# EAGLE design buffered-mult-pcb-b (EAGLE 7.2.0)
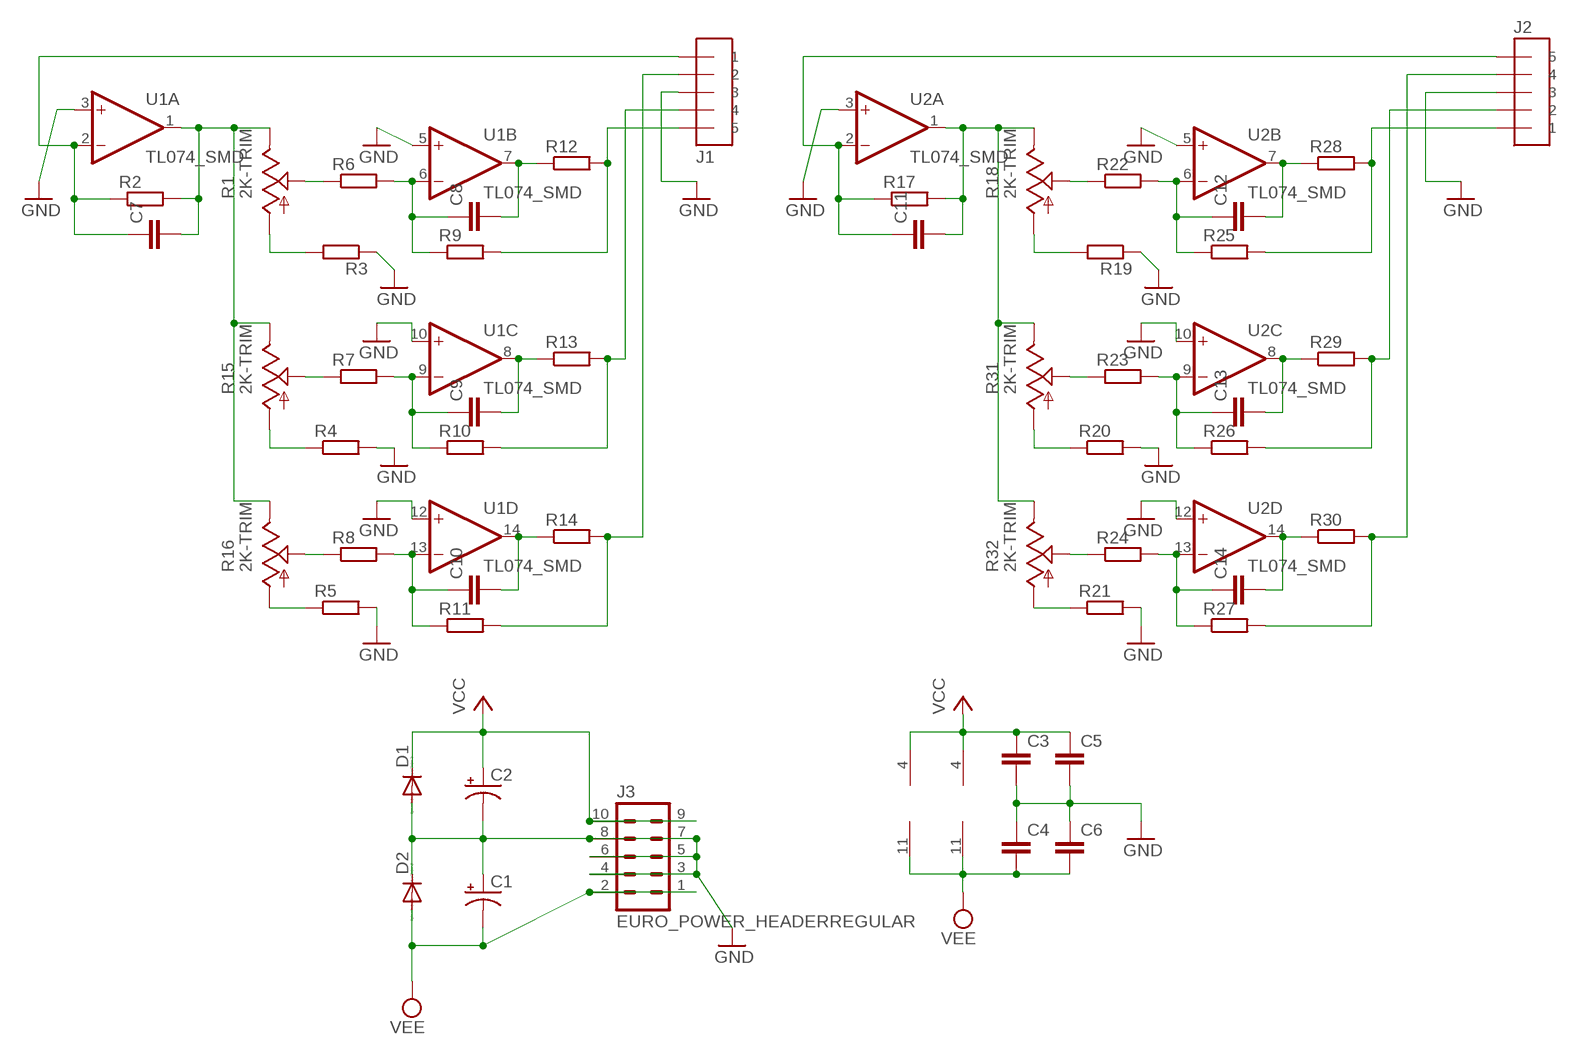
[diagram p0: schematic, sheet 1]

## Parts
C1  CPOL-USD  [PANASONIC_D]
C2  CPOL-USD  [PANASONIC_D]
C3  C-EUC0603  [C0603]
C4  C-EUC0603  [C0603]
C5  C-EUC0603  [C0603]
C6  C-EUC0603  [C0603]
C7  C-EUC0603  [C0603]
C8  C-EUC0603  [C0603]
C9  C-EUC0603  [C0603]
C10  C-EUC0603  [C0603]
C11  C-EUC0603  [C0603]
C12  C-EUC0603  [C0603]
C13  C-EUC0603  [C0603]
C14  C-EUC0603  [C0603]
D1  DIODE-SOD123  [SOD123]
D2  DIODE-SOD123  [SOD123]
J1  5X1_2_54_HEADER  [5X1_2_54_HEADER]
J2  5X1_2_54_HEADER  [5X1_2_54_HEADER]
J3  EURO_POWER_HEADERREGULAR  [EURO_POWER_HEADER]
R1  2K-TRIM  BOURNS_TRIM_3303X3_SMD  [BOURNS_TRIM_3303X3_SMD]
R2  R-EU_R0603  [R0603]
R3  R-EU_R0603  [R0603]
R4  R-EU_R0603  [R0603]
R5  R-EU_R0603  [R0603]
R6  R-EU_R0603  [R0603]
R7  R-EU_R0603  [R0603]
R8  R-EU_R0603  [R0603]
R9  R-EU_R0603  [R0603]
R10  R-EU_R0603  [R0603]
R11  R-EU_R0603  [R0603]
R12  R-EU_R0603  [R0603]
R13  R-EU_R0603  [R0603]
R14  R-EU_R0603  [R0603]
R15  2K-TRIM  BOURNS_TRIM_3303X3_SMD  [BOURNS_TRIM_3303X3_SMD]
R16  2K-TRIM  BOURNS_TRIM_3303X3_SMD  [BOURNS_TRIM_3303X3_SMD]
R17  R-EU_R0603  [R0603]
R18  2K-TRIM  BOURNS_TRIM_3303X3_SMD  [BOURNS_TRIM_3303X3_SMD]
R19  R-EU_R0603  [R0603]
R20  R-EU_R0603  [R0603]
R21  R-EU_R0603  [R0603]
R22  R-EU_R0603  [R0603]
R23  R-EU_R0603  [R0603]
R24  R-EU_R0603  [R0603]
R25  R-EU_R0603  [R0603]
R26  R-EU_R0603  [R0603]
R27  R-EU_R0603  [R0603]
R28  R-EU_R0603  [R0603]
R29  R-EU_R0603  [R0603]
R30  R-EU_R0603  [R0603]
R31  2K-TRIM  BOURNS_TRIM_3303X3_SMD  [BOURNS_TRIM_3303X3_SMD]
R32  2K-TRIM  BOURNS_TRIM_3303X3_SMD  [BOURNS_TRIM_3303X3_SMD]
U1  TL074_SMD  [SO14]
U2  TL074_SMD  [SO14]

## Nets
GND: C1.+ C2.- C3.2 C4.1 C5.2 C6.1 D1.A D2.C J1.3 J2.3 J3.3 J3.4 J3.5 J3.6 J3.7 J3.8 R3.1 R4.2 R5.2 R19.1 R20.2 R21.2 U1.3(A:+IN) U1.5(B:+IN) U1.10(C:+IN) U1.12(D:+IN) U2.3(A:+IN) U2.5(B:+IN) U2.10(C:+IN) U2.12(D:+IN)
N$1: C7.1 J1.1 R2.1 U1.2(A:-IN)
N$2: C7.2 R1.1(E) R2.2 R15.1(E) R16.1(E) U1.1(A:OUT)
N$3: R1.2(S) R6.1
N$4: C8.1 R6.2 R9.1 U1.6(B:-IN)
N$5: C8.2 R12.1 U1.7(B:OUT)
N$6: J1.5 R9.2 R12.2
N$7: R7.1 R15.2(S)
N$8: R1.3(A) R3.2
N$9: C9.1 R7.2 R10.1 U1.9(C:-IN)
N$10: C9.2 R13.1 U1.8(C:OUT)
N$11: J1.4 R10.2 R13.2
N$12: J1.2 R11.2 R14.2
N$13: R4.1 R15.3(A)
N$14: R8.1 R16.2(S)
N$15: C10.1 R8.2 R11.1 U1.13(D:-IN)
N$16: R5.1 R16.3(A)
N$17: C10.2 R14.1 U1.14(D:OUT)
N$19: C11.1 J2.5 R17.1 U2.2(A:-IN)
N$20: C11.2 R17.2 R18.1(E) R31.1(E) R32.1(E) U2.1(A:OUT)
N$21: R18.2(S) R22.1
N$22: C12.1 R22.2 R25.1 U2.6(B:-IN)
N$23: C12.2 R28.1 U2.7(B:OUT)
N$24: J2.1 R25.2 R28.2
N$25: R18.3(A) R19.2
N$26: R23.1 R31.2(S)
N$27: C13.1 R23.2 R26.1 U2.9(C:-IN)
N$28: C13.2 R29.1 U2.8(C:OUT)
N$29: J2.2 R26.2 R29.2
N$30: R20.1 R31.3(A)
N$31: R24.1 R32.2(S)
N$32: C14.1 R24.2 R27.1 U2.13(D:-IN)
N$33: R21.1 R32.3(A)
N$34: C14.2 R30.1 U2.14(D:OUT)
N$35: J2.4 R27.2 R30.2
VCC: C2.+ C3.1 C5.1 D1.C J3.9 J3.10 U1.4(P:V+) U2.4(P:V+)
VEE: C1.- C4.2 C6.2 D2.A J3.1 J3.2 U1.11(P:V-) U2.11(P:V-)

## Library data of the parts
C1 C2 = rcl:CPOL-US: POLARIZED CAPACITOR, American symbol
C3-C14 = rcl:C-EU: CAPACITOR, European symbol
D1 D2 = diode:DIODE-: DIODE
J1 J2 = mjb-parts:5X1_2_54_HEADER
J3 = mjb-parts:EURO_POWER_HEADER: Power Header 10 pin power header for Eurorack Power Supplies Variants with fatter pads for easier soldering, and the LOCK variant which has 5mil offset pins to hold the component in place before soldering
R1 R15 R16 R18 R31 R32 = mjb-parts:BOURNS_TRIM_3303X3_SMD
R2-R14 R17 R19-R30 = rcl:R-EU_: RESISTOR, European symbol
U1 U2 = MusicThingModular:TL074: Generic Quad Op Amp

## Board
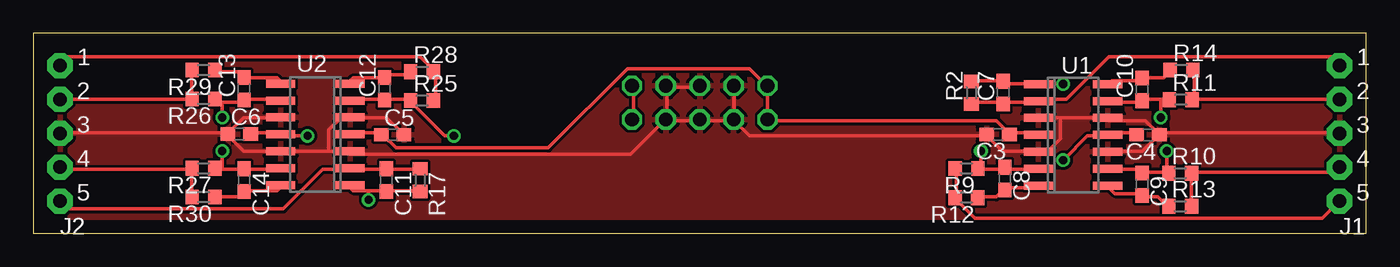
[diagram p1: board, top side]
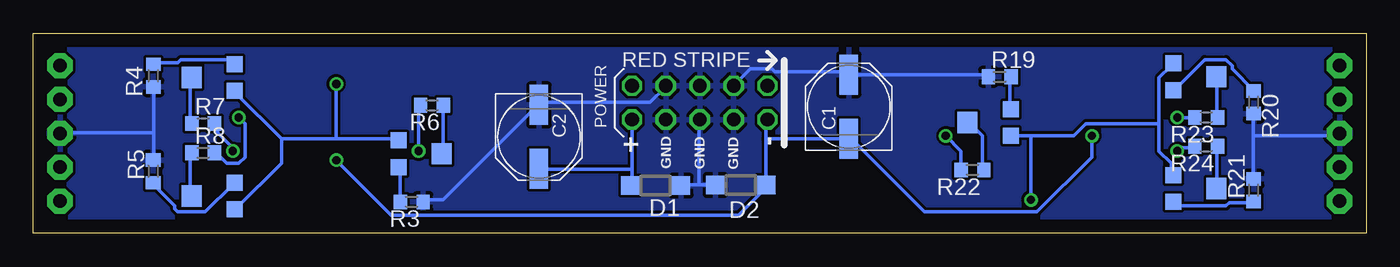
[diagram p2: board, bottom side, seen from below]

Size 100 x 15 mm. Coordinates in mm from the lower left corner, seen from the top.
Outline: 0,0 100,0 100,15 0,15 0,0
Copper layers (1*16): Top 0.035mm / dielectric 1.5mm / Bottom 0.035mm
Design rules "default": minimum track width 10mil, minimum drill 24mil, track to track 8mil, track to pad 8mil, pad to pad 8mil, via to via 8mil, smd to smd 8mil, copper to edge 40mil, drill to drill 8mil, minimum pad ring 10mil, minimum via ring 8mil, stop-mask expansion 4mil, vias tented up to drill 0mil, thermal gap 10mil

### Footprints (pad centres in the part's own frame; a part is rotated, then mirrored left to right if it is on the bottom)
PANASONIC_D = smd 3 x 1.4: + 2.4,0; - -2.4,0
C0603 = smd 1.1 x 1: 1 -0.85,0; 2 0.85,0
SOD123 = smd 1.4 x 1.4: A 1.9,0; C -1.9,0
5X1_2_54_HEADER = drill 1.016 pad 1.88 octagon: 1 0,5.08; 2 0,2.54; 3 0,0; 4 0,-2.54; 5 0,-5.08
EURO_POWER_HEADER = drill 1.016 octagon: 1 -5.08,-1.27; 2 -5.08,1.27; 3 -2.54,-1.27; 4 -2.54,1.27; 5 0,-1.27; 6 0,1.27; 7 2.54,-1.27; 8 2.54,1.27; 9 5.08,-1.27; 10 5.08,1.27
BOURNS_TRIM_3303X3_SMD = smd 1.2 x 1.2: 1 -1,-1.59; 3 1,-1.59 | smd 1.6 x 1.5: 2 0,1.65
R0603 = smd 1 x 1.1: 1 -0.85,0; 2 0.85,0
SO14 = smd 0.6 x 2.2: 1 -3.81,-2.6; 2 -2.54,-2.6; 3 -1.27,-2.6; 4 0,-2.6; 5 1.27,-2.6; 6 2.54,-2.6; 7 3.81,-2.6; 8 3.81,2.6; 9 2.54,2.6; 10 1.27,2.6; 11 0,2.6; 12 -1.27,2.6; 13 -2.54,2.6; 14 -3.81,2.6

### Placement (x,y rotation side)
C1  38.82,9.5 90 bottom
C2  62.06,7.23 270 bottom
C3  72.38,7.42 180 top
C4  83.63,7.39 180 top
C5  26.96,7.39 0 top
C6  15.46,7.45 0 top
C7  72.77,10.56 90 top
C8  72.89,4.11 270 top
C9  83.19,3.68 270 top
C10  83.19,10.79 90 top
C11  26.48,3.99 270 top
C12  26.36,10.85 90 top
C13  15.82,10.85 90 top
C14  15.82,3.99 270 top
D1  53.32,3.58 0 bottom
D2  46.92,3.63 0 bottom
J1  98,7.5 0 top
J2  2,7.5 0 top
J3  50,9.8 180 bottom
R1  71.01,5.97 270 bottom
R2  70.39,10.54 90 top
R3  71.6,2.36 180 bottom
R4  90.99,11.83 270 bottom
R5  91,4.64 90 bottom
R6  70.09,9.61 180 bottom
R7  87.25,8.24 0 bottom
R8  87.26,6.04 0 bottom
R9  70.02,4.87 180 top
R10  86.04,4.51 0 top
R11  86.09,10.02 0 top
R12  70,2.67 180 top
R13  86.04,2.03 0 top
R14  86.15,12.25 0 top
R15  86.49,11.68 90 bottom
R16  86.49,2.79 90 bottom
R17  29.02,3.99 270 top
R18  28.26,8.31 90 bottom
R19  27.5,11.74 0 bottom
R20  8.45,9.83 270 bottom
R21  8.45,3.23 90 bottom
R22  29.53,4.75 180 bottom
R23  12.01,8.69 180 bottom
R24  12.01,6.53 180 bottom
R25  29.15,9.96 0 top
R26  12.77,10.09 180 top
R27  12.77,4.88 180 top
R28  29.15,12.12 0 top
R29  12.77,12.25 180 top
R30  12.77,2.72 180 top
R31  12.89,11.74 270 bottom
R32  12.89,3.36 270 bottom
U1  78.01,7.38 270 top
U2  21.15,7.42 90 top

### Tracks (layer width: path | path; a pad name or v marks a point on that pad's centre or on a via)
GND
  Top 0.254: C4.1 84.35,7.54 83.44,8.46 80.7,8.46 U1.12 80.47,8.69 77.04,8.69 | 77.04,8.69 75.44,8.69 U1.3 | U1.10 80.7,6.17 83.21,6.17 84.35,7.32 C4.1 | 77.04,8.69 77.04,7.09 76.12,6.17 75.44,6.17 U1.5 75.21,6.17 72.69,6.17 71.55,7.32 C3.2 71.32,7.32 53.72,7.32 52.58,8.46 J3.8 | J1.3 97.84,7.54 84.58,7.54 C4.1 | C5.2 27.66,7.54 26.52,8.69 23.77,8.69 U2.5 23.55,8.69 23.09,8.69 22.17,7.77 22.17,6.17 | C6.1 14.63,7.54 15.77,8.69 18.52,8.69 U2.10 | C6.1 14.63,7.32 15.77,6.17 18.52,6.17 U2.12 18.75,6.17 22.17,6.17 | 22.17,6.17 23.55,6.17 U2.3 23.77,5.94 44.81,5.94 47.32,8.46 J3.4 | J2.3 2.06,7.54 14.4,7.54 C6.1 | 47.55,10.97 49.84,10.97 J3.5 | J3.4 47.55,8.46 49.84,8.46 J3.6 50.06,8.46 52.35,8.46 J3.8 | J3.7 52.58,10.97 52.58,8.69 J3.8 | 47.55,10.97 47.55,8.69 J3.4 | 47.55,10.97 J3.3
  Bottom 0.254: 90.98,7.54 R4.2 | 90.98,7.54 90.98,5.71 R5.2 | 90.98,7.54 97.84,7.54 J1.3 | 8.46,7.32 8.46,8.91 R20.2 | 8.46,7.32 8.46,4.12 R21.2 | 8.46,7.32 2.06,7.32 J2.3 | R3.1 70.64,2.52 69.27,2.52 62.18,9.6 C2.- 61.95,9.83 53.72,9.83 52.58,10.97 J3.7 | R19.1 28.57,11.89 38.63,11.89 C1.+ 38.86,12.12 44.35,12.12 44.58,12.34 46.18,12.34 47.32,11.2 J3.3 | 50.06,3.66 51.21,3.66 D1.A | 50.06,3.66 48.92,3.66 D2.C | 50.06,3.66 50.06,8.46 J3.6
  pour Bottom: 0,0 0,15 100,15 100,0
  pour Top: 0,0 0,15 100,15 100,0
N$1
  Top 0.254: R2.1 70.41,9.83 72.69,9.83 C7.1 72.92,9.83 75.21,9.83 U1.2 75.44,10.06 77.5,10.06 80.7,13.26 97.38,13.26 97.84,12.8 J1.1
N$2  (via drill 0.61)
  Top 0.254: R2.2 70.41,11.43 72.69,11.43 C7.2 72.92,11.2 75.21,11.2 U1.1 75.44,11.2 v77.27,11.2
  Bottom 0.254: 81.38,7.09 77.27,7.09 | 77.27,7.09 72.69,7.09 R1.1 | 81.38,7.09 84.81,10.52 R15.1 | 81.38,7.09 81.38,5.26 84.81,1.83 R16.1 | 77.27,7.09 v77.27,11.2
N$3
  Bottom 0.254: R6.1 69.27,9.6 69.27,6.17 R1.2
N$4  (via drill 0.61)
  Top 0.254: v71.09,6.17 71.09,5.03 R9.1 71.09,4.8 72.69,4.8 C8.1 72.92,4.8 75.21,4.8 U1.6
  Bottom 0.254: v71.09,6.17 71.09,9.6 R6.2
N$5
  Top 0.254: R12.1 70.87,2.74 72.24,2.74 72.69,3.2 C8.2 72.92,3.43 75.21,3.43 U1.7
N$6
  Top 0.254: R9.2 69.27,4.8 69.27,2.74 R12.2 69.27,2.52 70.64,1.14 96.7,1.14 97.84,2.29 J1.5
N$7
  Bottom 0.254: R7.1 88.24,8.46 88.24,11.66 R15.2
N$8
  Bottom 0.254: R3.2 72.47,2.52 72.47,4.8 R1.3
N$9  (via drill 0.61)
  Top 0.254: 85.04,4.57 83.21,4.57 C9.1 82.98,4.57 82.75,4.8 80.7,4.8 U1.9 | 85.04,4.57 v85.04,6.17 | 85.04,4.57 R10.1
  Bottom 0.254: v85.04,6.17 85.04,6.4 86.18,7.54 86.18,8.23 R7.2
N$10
  Top 0.254: R13.1 85.04,2.06 84.35,2.74 83.21,2.74 C9.2 82.98,2.97 81.15,2.97 80.7,3.43 U1.8
N$11
  Top 0.254: R13.2 86.87,2.06 86.87,4.34 R10.2 87.1,4.57 97.61,4.57 97.84,4.8 J1.4
N$12
  Top 0.254: 87.1,10.06 87.1,12.12 R14.2 | 87.1,10.06 97.84,10.06 J1.2 | 87.1,10.06 R11.2
N$13
  Bottom 0.254: R4.1 90.98,12.8 89.15,12.8 88.92,13.03 85.27,13.03 85.04,12.8 R15.3
N$14
  Bottom 0.254: R8.1 88.24,5.94 88.24,2.97 R16.2
N$15  (via drill 0.61)
  Top 0.254: 84.58,10.06 85.04,10.06 R11.1 | 84.58,10.06 83.21,10.06 C10.1 82.98,9.83 80.7,9.83 U1.13 | 84.58,10.06 v84.58,8.69
  Bottom 0.254: v84.58,8.69 84.12,8.23 84.12,5.71 84.58,5.26 85.5,5.26 86.18,5.94 R8.2
N$16
  Bottom 0.254: R5.1 90.98,3.66 89.38,2.06 89.38,1.83 89.15,1.6 87.1,1.6 85.04,3.66 R16.3
N$17
  Top 0.254: R14.1 85.27,12.12 84.81,11.66 83.21,11.66 C10.2 82.98,11.43 80.92,11.43 80.7,11.2 U1.14
N$19
  Top 0.254: R17.1 28.8,4.8 26.52,4.8 C11.1 26.29,4.8 23.77,4.8 U2.2 23.55,4.8 21.72,4.8 18.75,1.83 2.52,1.83 2.06,2.29 J2.5
N$20  (via drill 0.61)
  Top 0.254: R17.2 28.8,3.2 26.52,3.2 C11.2 26.29,3.2 25.15,3.2 | 25.15,3.2 24,3.2 23.77,3.43 U2.1 | v25.15,2.52 25.15,3.2
  Bottom 0.254: 15.54,8.23 15.54,11.66 14.63,12.57 R31.1 | 15.54,8.23 15.54,6.17 14.63,5.26 14.63,4.57 R32.1 | 25.15,7.32 21.95,7.32 21.03,8.23 15.54,8.23 | 25.15,7.32 26.52,7.32 R18.1 | 25.15,7.32 v25.15,2.52
N$21
  Bottom 0.254: R22.1 28.8,4.8 28.8,7.32 29.72,8.23 R18.2
N$22  (via drill 0.61)
  Top 0.254: v31.55,7.32 30.86,7.32 28.35,9.83 R25.1 28.12,10.06 26.52,10.06 C12.1 26.29,10.06 23.77,10.06 U2.6
  Bottom 0.254: v31.55,7.32 30.4,6.17 30.4,4.8 R22.2
N$23
  Top 0.254: R28.1 28.12,12.12 27.89,11.89 26.52,11.89 C12.2 26.29,11.66 24,11.66 23.77,11.43 U2.7
N$24
  Top 0.254: R25.2 30.18,10.06 30.18,12.12 R28.2 29.95,12.34 29.03,13.26 2.52,13.26 2.06,12.8 J2.1
N$25
  Bottom 0.254: R19.2 26.75,11.66 26.75,9.37 R18.3
N$26
  Bottom 0.254: R23.1 11.2,8.91 11.2,11.66 R31.2
N$27  (via drill 0.61)
  Top 0.254: v14.17,8.69 14.17,9.6 13.95,9.83 | 13.95,9.83 13.72,10.06 R26.1 13.95,9.83 | 13.95,9.83 15.77,9.83 C13.1 16,10.06 18.52,10.06 U2.9
  Bottom 0.254: v14.17,8.69 13.03,8.69 R23.2
N$28
  Top 0.254: R29.1 13.72,12.12 15.54,12.12 15.77,11.89 C13.2 16,11.66 18.29,11.66 18.52,11.43 U2.8
N$29
  Top 0.254: R29.2 11.89,12.12 11.89,10.29 R26.2 11.89,10.06 2.06,10.06 J2.2
N$30
  Bottom 0.254: R20.1 8.46,10.74 10.06,12.34 10.06,12.57 10.52,13.03 12.12,13.03 14.4,10.74 R31.3
N$31
  Bottom 0.254: R24.1 11.2,6.4 11.2,3.43 R32.2
N$32  (via drill 0.61)
  Top 0.254: 14.17,4.8 15.77,4.8 C14.1 16,4.8 18.52,4.8 U2.13 | 14.17,4.8 13.72,4.8 R27.1 | 14.17,4.8 v14.17,6.17
  Bottom 0.254: v14.17,6.17 13.95,6.4 13.03,6.4 R24.2
N$33
  Bottom 0.254: R21.1 8.46,2.29 10.29,2.29 10.52,2.06 14.17,2.06 14.4,2.29 R32.3
N$34
  Top 0.254: R30.1 13.72,2.74 15.54,2.74 15.77,2.97 C14.2 16,3.2 18.29,3.2 18.52,3.43 U2.14
N$35
  Top 0.254: 11.89,4.8 11.89,2.74 R30.2 | 11.89,4.8 2.06,4.8 J2.4 | 11.89,4.8 R27.2
VCC
  Top 0.254: U1.4 75.21,7.54 73.38,7.54 C3.1 73.15,7.54 72.24,8.46 55.09,8.46 J3.10 55.09,8.69 55.09,10.97 J3.9 54.86,11.2 53.72,12.34 44.58,12.34 38.63,6.4 27.2,6.4 26.29,7.32 C5.1 26.06,7.54 23.77,7.54 U2.4
  Bottom 0.254: 55.09,4.8 55.09,8.46 J3.10 | 55.09,4.8 55.09,3.66 D1.C | 55.09,4.8 61.95,4.8 C2.+
VEE  (via drill 0.61)
  Top 0.254: C6.2 16.46,7.54 18.52,7.54 U2.11 18.75,7.32 v20.57,7.32 | C4.2 82.75,7.54 80.7,7.54 U1.11 80.47,7.32 79.1,7.32 v77.27,5.49 | J3.1 45.03,10.97 45.03,8.69 J3.2
  Bottom 0.254: v20.57,7.32 20.57,5.71 24.69,1.6 33.15,1.6 38.63,7.09 C1.- 38.86,7.09 45.03,7.09 | 45.03,7.09 45.03,8.46 J3.2 | 45.03,7.09 45.03,3.66 D2.A 45.03,3.43 47.09,1.37 73.15,1.37 v77.27,5.49